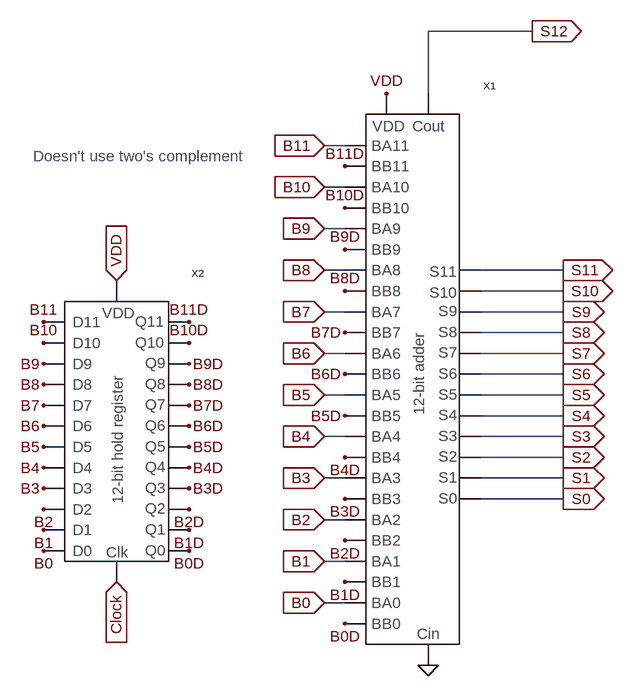
[diagram p0: schematic 12_bit_averager.asc]
12_bit_averager.asc, the LTspice schematic file:
Version 4
SHEET 1 1900 932
WIRE 400 -1216 240 -1216
WIRE 240 -1120 240 -1216
WIRE 112 -1040 80 -1040
WIRE 112 -976 80 -976
WIRE 112 -912 80 -912
WIRE 112 -848 80 -848
WIRE 448 -848 320 -848
WIRE 448 -816 320 -816
WIRE 112 -784 80 -784
WIRE 448 -784 320 -784
WIRE 448 -752 320 -752
WIRE 112 -720 80 -720
WIRE 448 -720 320 -720
WIRE 448 -688 320 -688
WIRE 112 -656 80 -656
WIRE 448 -656 320 -656
WIRE 448 -624 320 -624
WIRE 112 -592 80 -592
WIRE 448 -592 320 -592
WIRE 448 -560 320 -560
WIRE 112 -528 80 -528
WIRE 448 -528 320 -528
WIRE 448 -496 320 -496
WIRE 112 -464 80 -464
WIRE 112 -400 80 -400
WIRE 112 -336 80 -336
FLAG 80 -784 B7
IOPIN 80 -784 In
FLAG 80 -720 B6
IOPIN 80 -720 In
FLAG 80 -656 B5
IOPIN 80 -656 In
FLAG 80 -592 B4
IOPIN 80 -592 In
FLAG 80 -528 B3
IOPIN 80 -528 In
FLAG 80 -464 B2
IOPIN 80 -464 In
FLAG 80 -400 B1
IOPIN 80 -400 In
FLAG 80 -336 B0
IOPIN 80 -336 In
FLAG 80 -976 B10
IOPIN 80 -976 In
FLAG 80 -912 B9
IOPIN 80 -912 In
FLAG 80 -848 B8
IOPIN 80 -848 In
FLAG 176 -1120 VDD
FLAG 240 -240 0
FLAG -240 -832 VDD
IOPIN -240 -832 In
FLAG -240 -368 Clock
IOPIN -240 -368 In
FLAG 448 -816 S10
IOPIN 448 -816 Out
FLAG 448 -784 S9
IOPIN 448 -784 Out
FLAG 448 -752 S8
IOPIN 448 -752 Out
FLAG 448 -720 S7
IOPIN 448 -720 Out
FLAG 448 -688 S6
IOPIN 448 -688 Out
FLAG 448 -656 S5
IOPIN 448 -656 Out
FLAG 448 -624 S4
IOPIN 448 -624 Out
FLAG 448 -592 S3
IOPIN 448 -592 Out
FLAG 448 -560 S2
IOPIN 448 -560 Out
FLAG 448 -528 S1
IOPIN 448 -528 Out
FLAG 448 -496 S0
IOPIN 448 -496 Out
FLAG 80 -1040 B11
IOPIN 80 -1040 In
FLAG 448 -848 S11
IOPIN 448 -848 Out
FLAG -352 -768 B11
FLAG -352 -736 B10
FLAG -352 -704 B9
FLAG -352 -672 B8
FLAG -352 -640 B7
FLAG -352 -608 B6
FLAG -352 -576 B5
FLAG -352 -544 B4
FLAG -352 -512 B3
FLAG -352 -480 B2
FLAG -352 -448 B1
FLAG -352 -416 B0
FLAG -128 -768 B11D
FLAG 112 -1008 B11D
FLAG 112 -944 B10D
FLAG -128 -736 B10D
FLAG 112 -880 B9D
FLAG -128 -704 B9D
FLAG 112 -816 B8D
FLAG -128 -672 B8D
FLAG -128 -640 B7D
FLAG 112 -752 B7D
FLAG -128 -608 B6D
FLAG 112 -688 B6D
FLAG 112 -624 B5D
FLAG -128 -576 B5D
FLAG 112 -560 B4D
FLAG -128 -544 B4D
FLAG 112 -496 B3D
FLAG -128 -512 B3D
FLAG 112 -432 B2D
FLAG -128 -480 B2D
FLAG 112 -368 B1D
FLAG -128 -448 B1D
FLAG 112 -304 B0D
FLAG -128 -416 B0D
FLAG 400 -1216 S12
IOPIN 400 -1216 Out
SYMBOL 12_bit_adder 144 -272 R0
SYMATTR InstName X1
SYMBOL 12_bit_register -320 -400 R0
SYMATTR InstName X2
TEXT -368 -1024 Left 0 ;Doesn't use two's complement

The netlist it stands for:
* 12_bit_averager.asc
XX1 VDD B0 B0D B1 B1D B2 B2D B3 B3D B4 B4D B5 B5D B6 B6D B7 B7D S0 S12 0 S1 S2 S3 S4 S5 S6 S7 S8 S9 S10 S11 B8 B8D B9 B9D B10 B10D B11 B11D 12_bit_adder  ; pins VDD BA0 BB0 BA1 BB1 BA2 BB2 BA3 BB3 BA4 BB4 BA5 BB5 BA6 BB6 BA7 BB7 S0 Cout Cin S1 S2 S3 S4 S5 S6 S7 S8 S9 S10 S11 BA8 BB8 BA9 BB9 BA10 BB10 BA11 BB11
XX2 B0 B1 B2 B3 B4 B5 B6 B7 B8 B9 B10 B11 B0D B1D B2D B3D B4D B5D B6D B7D B8D B9D B10D B11D Clock VDD 12_bit_register  ; pins D0 D1 D2 D3 D4 D5 D6 D7 D8 D9 D10 D11 Q0 Q1 Q2 Q3 Q4 Q5 Q6 Q7 Q8 Q9 Q10 Q11 Clk VDD
* Doesn't use two's complement
.backanno
.end